# Altium project SecurityCard.PrjPcb (part 1 of 3)
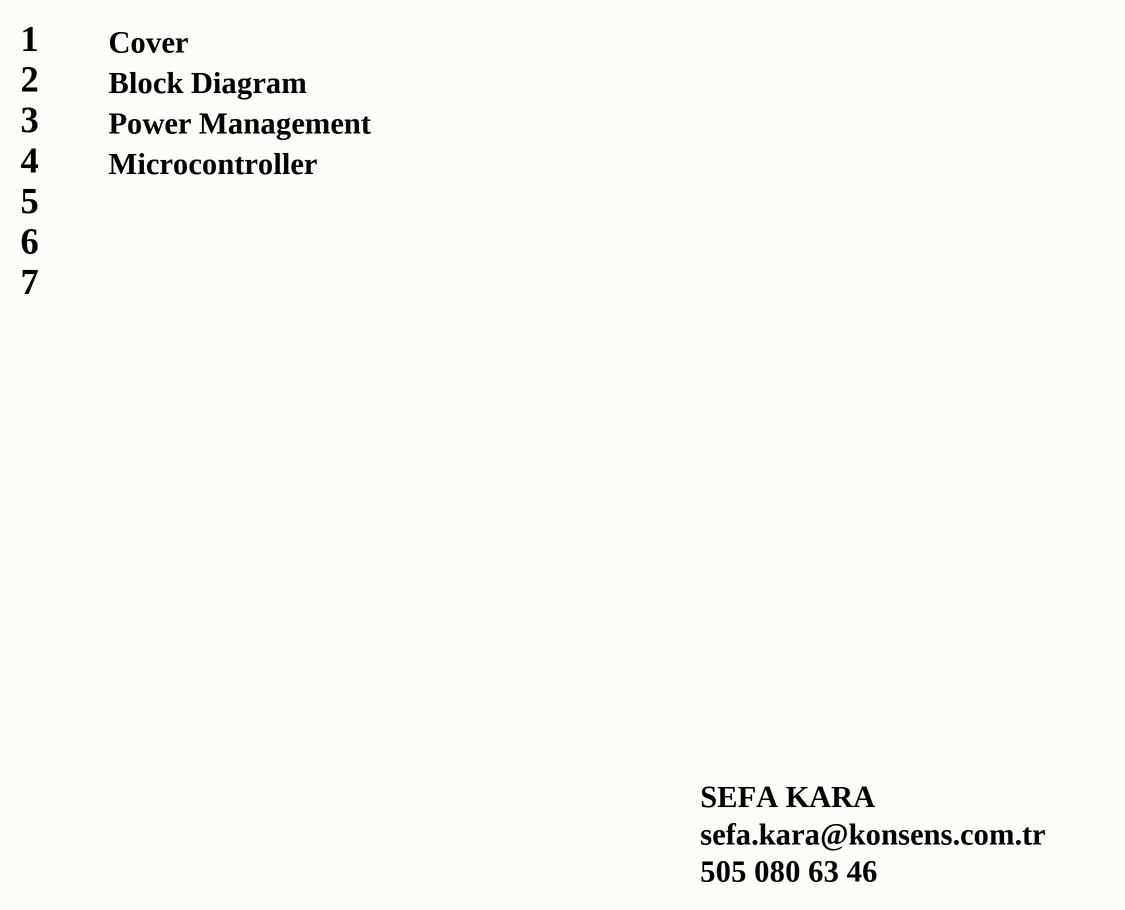
[diagram p0: Cover.SchDoc]
5 sheets, 124 parts. Net scope: flat (ports and power ports of the same name join across sheets).
Board file: SecurityCard.PcbDoc
Sheets:
  Cover.SchDoc
  BlockDiagram.SchDoc
  Power Management.SchDoc
  Microcontroller.SchDoc
  SensorBoard.SchDoc

## Sheet Cover.SchDoc
size A3; Date: 08/07/2024; ApprovedBy: SEFA KARA; CheckedBy: SEFA KARA; CompanyName: KONSENS TECH; Engineer: SEFA KARA; Revision: V1.0; SheetNumber: 1; SheetTotal: 4; PreparedBy: SEFA KARA; Project: SECURITY CARD; ReleaseDate: 08/07/2024; ChangedDate: 08/07/2024; RevisionDate: 08/07/2024; PreparedDate: 08/07/2024; CheckedDate: 08/07/2024; ApprovedDate: 08/07/2024; Department: R&D; Rel Date: 08/07/2024; Change Date: 08/07/2024; Rev Date: 08/07/2024; Time: 19:34

### Notes on the sheet
- 1
- Cover
- 2
- Block Diagram
- 3
- 4
- Power Management
- Microcontroller
- 5
- 6
- 7
- SEFA KARA
- sefa.kara@konsens.com.tr
- 505 080 63 46
- CONTENTS
- REVISION
- PRODUCTION NOTES
- Page No
- Description
- Date
- PROPERTIES
- BOARD
- GERBER
- FILES
- APPENDICES
- CONTACT
- Company Name
- Engineer
- PROJECT
- Rel Date
- FILE NAME
- Checked By
- Approved By
- Rev Date
- Change Date
- Department
- Revision
- Sheet
- of

## Sheet BlockDiagram.SchDoc
size A3; SheetNumber: 2; SheetTotal: 2
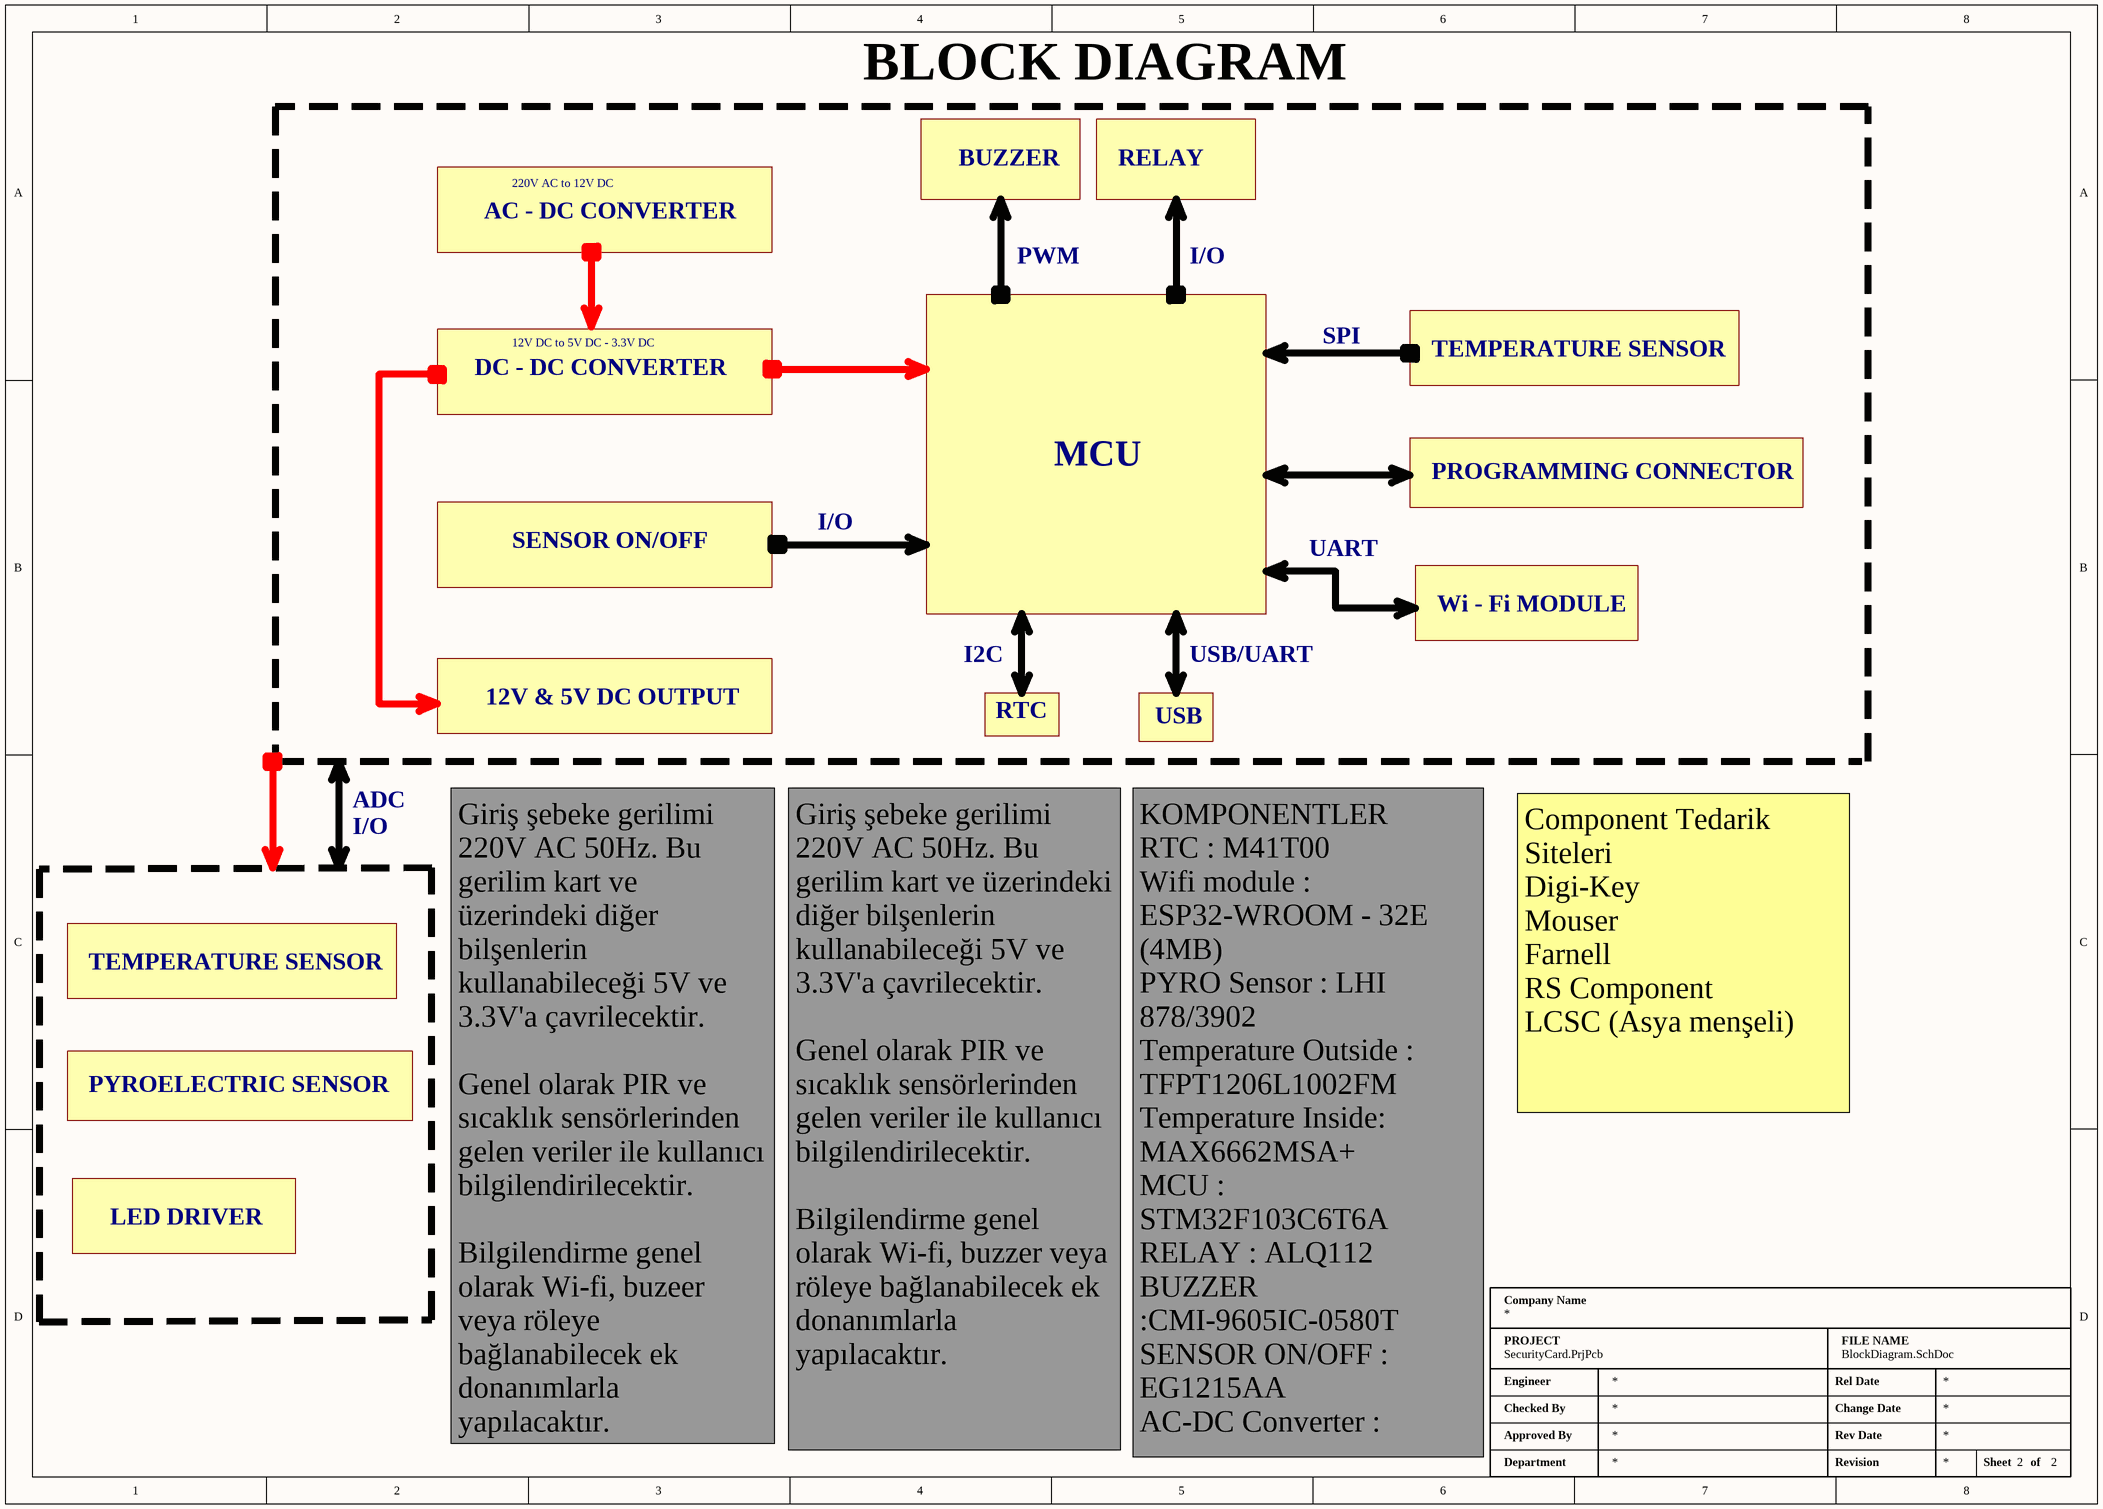
[diagram p1: BlockDiagram.SchDoc]

### Notes on the sheet
- BLOCK DIAGRAM
- BUZZER
- RELAY
- AC - DC CONVERTER
- 220V AC to 12V DC
- PWM
- I/O
- DC - DC CONVERTER
- 12V DC to 5V DC - 3.3V DC
- SPI
- TEMPERATURE SENSOR
- MCU
- PROGRAMMING CONNECTOR
- SENSOR ON/OFF
- UART
- Wi - Fi MODULE
- 12V & 5V DC OUTPUT
- I2C
- RTC
- USB/UART
- USB
- ADC
- PYROELECTRIC SENSOR
- Component Tedarik Siteleri
  Digi-Key
  Mouser
  Farnell
  RS Component
  LCSC (Asya menşeli)
- LED DRIVER
- Giriş şebeke gerilimi 220V AC 50Hz. Bu gerilim kart ve üzerindeki diğer bilşenlerin kullanabileceği 5V ve 3.3V'a çavrilecektir.
  Genel olarak PIR ve sıcaklık sensörlerinden gelen veriler ile kullanıcı bilgilendirilecektir.
  Bilgilendirme genel olarak Wi-fi, buzeer veya röleye bağlanabilecek ek donanımlarla yapılacaktır.
- Giriş şebeke gerilimi 220V AC 50Hz. Bu gerilim kart ve üzerindeki diğer bilşenlerin kullanabileceği 5V ve 3.3V'a çavrilecektir.
  Genel olarak PIR ve sıcaklık sensörlerinden gelen veriler ile kullanıcı bilgilendirilecektir.
  Bilgilendirme genel olarak Wi-fi, buzzer veya röleye bağlanabilecek ek donanımlarla yapılacaktır.
- KOMPONENTLER
  RTC : M41T00
  Wifi module : ESP32-WROOM - 32E (4MB)
  PYRO Sensor : LHI 878/3902
  Temperature Outside : TFPT1206L1002FM
  Temperature Inside: MAX6662MSA+
  MCU : STM32F103C6T6A
  RELAY : ALQ112
  BUZZER :CMI-9605IC-0580T
  SENSOR ON/OFF : EG1215AA
  AC-DC Converter :
  5VDC LM2675MX-12/NOPB
  3.3VDC AP7361-33E-13
  LED Driver Mosfet : SSM7K357R,LF
- Company Name
- Engineer
- PROJECT
- Rel Date
- FILE NAME
- Checked By
- Approved By
- Rev Date
- Change Date
- Department
- Revision
- Sheet
- of

## Sheet Power Management.SchDoc
size A3; ApprovedBy: SEFA KARA; CheckedBy: SEFA KARA; CompanyName: KONSENS TECH; Engineer: SEFA KARA; Revision: V1.0; SheetNumber: 3; SheetTotal: 4; Department: R&D; Rel Date: 17.08.2024; Change Date: 17.08.2024; Rev Date: 17.08.2024
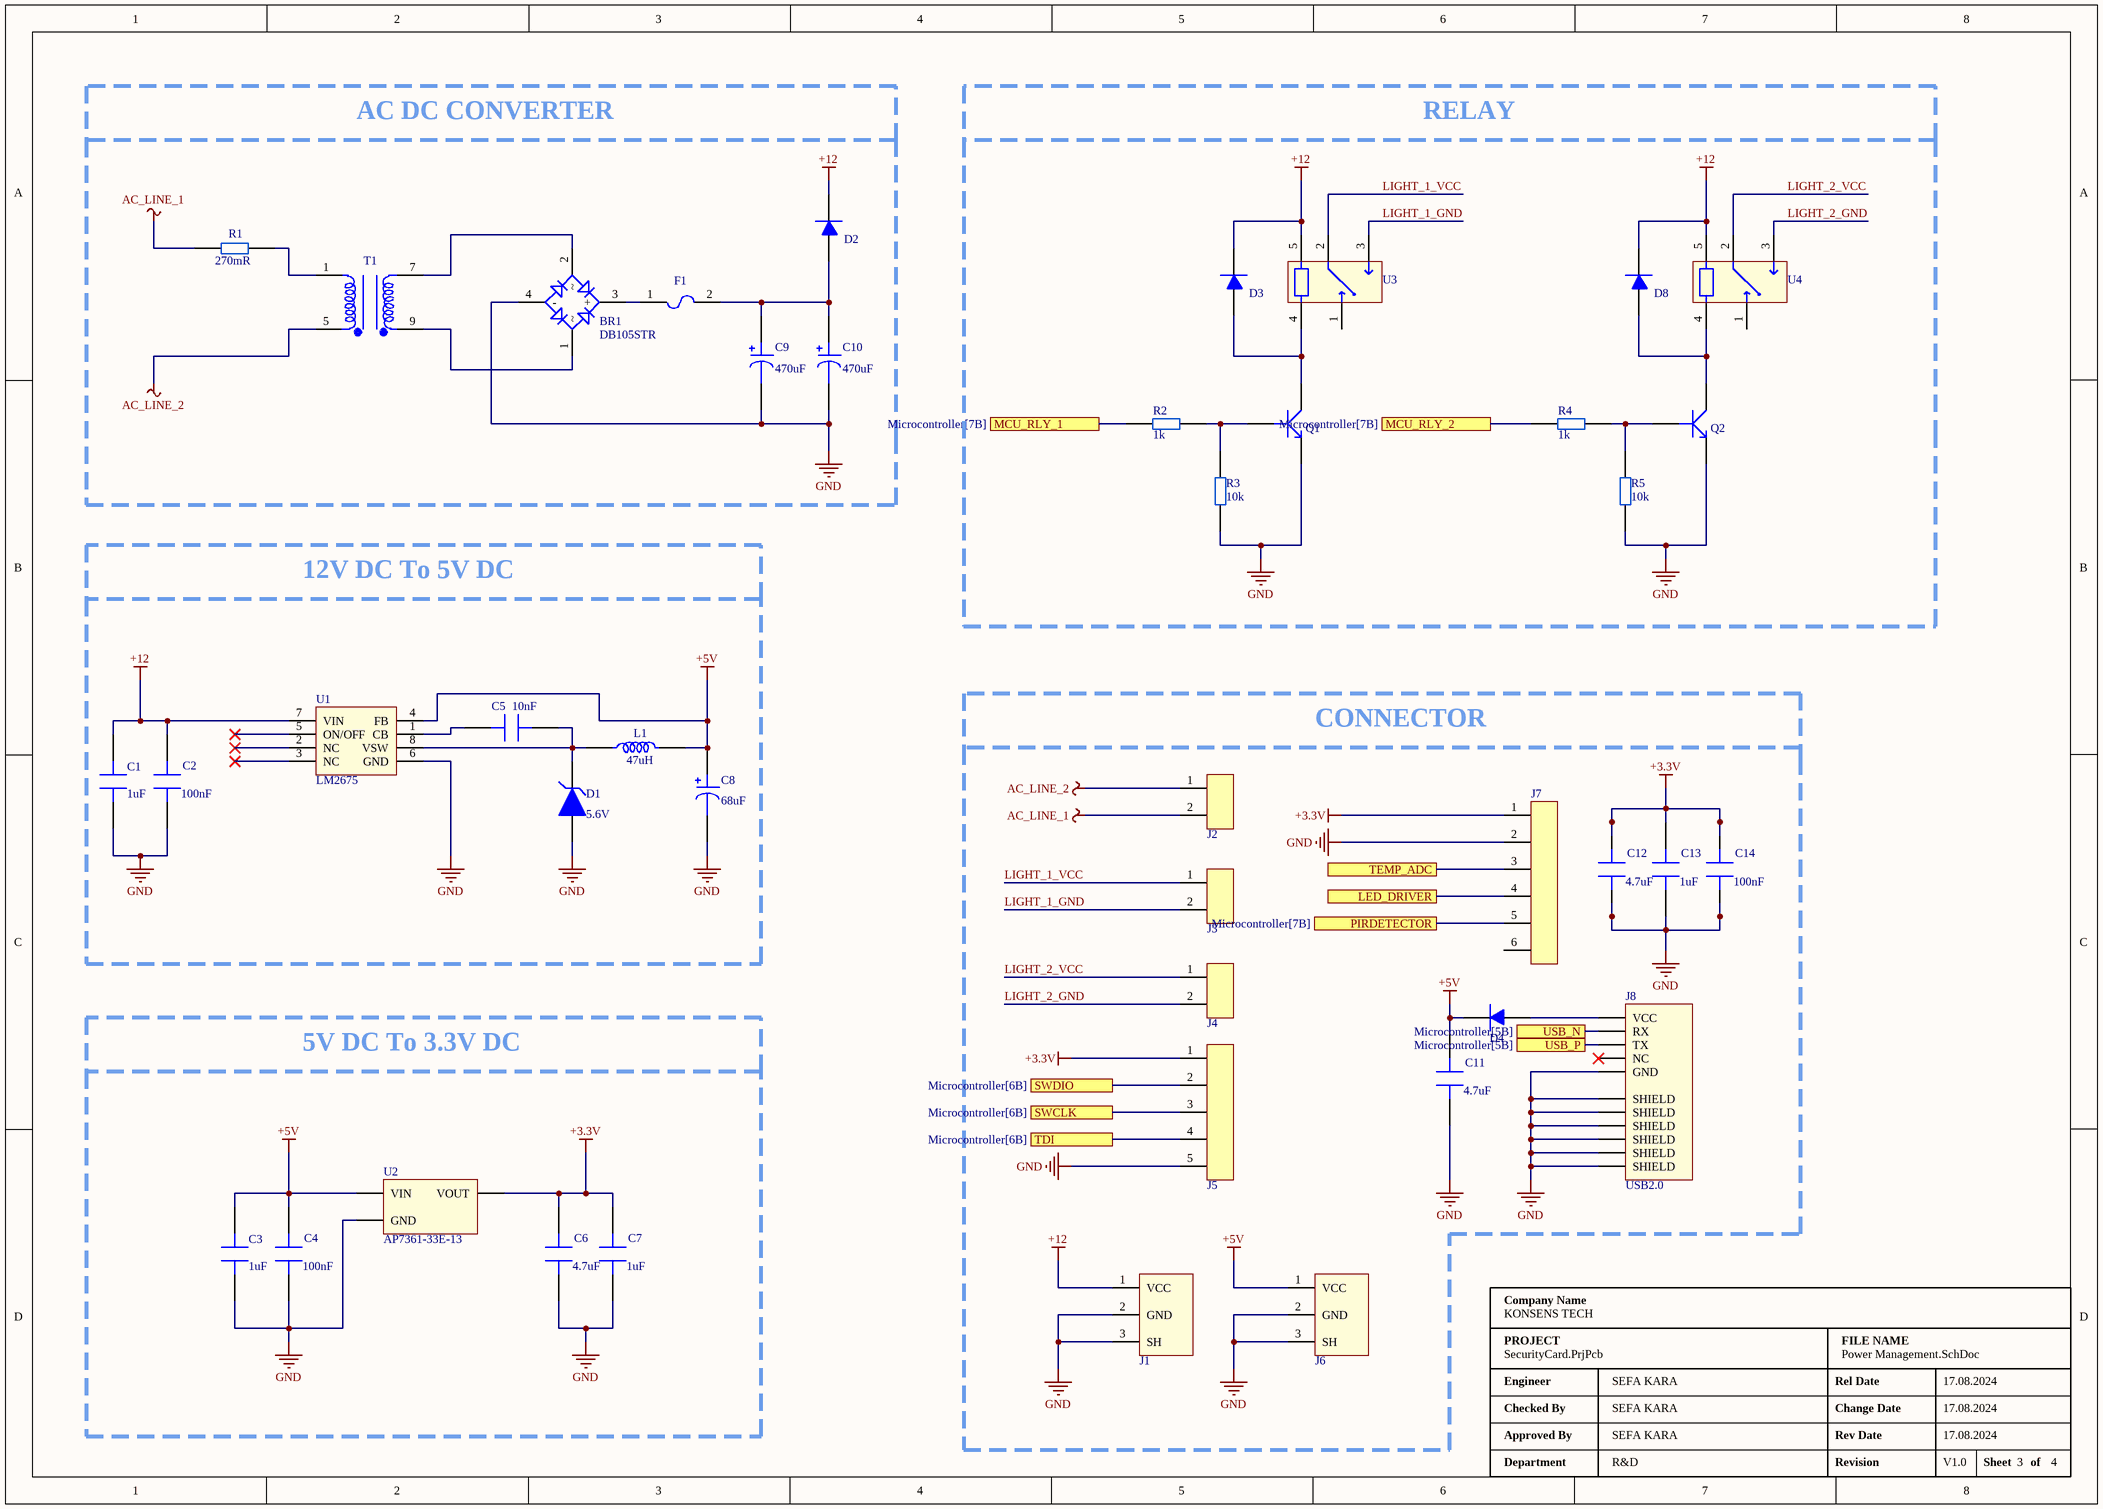
[diagram p2: Power Management.SchDoc]

### Parts
BR1  DB105STR  [DB107S]
C1  value 1uF  [CAP 0805]  (hidden comment: Auto Grade Capacitor,0805,X7R,10)
C2  value 100nF  [CAP 0805]  (hidden comment: CAP CER 0.1UF 50V X7R 0805)
C3  value 1uF  [CAP 0805]  (hidden comment: Auto Grade Capacitor,0805,X7R,10)
C4  value 100nF  [CAP 0805]  (hidden comment: CAP CER 0.1UF 50V X7R 0805)
C5  value 10nF  [CAP 0603]  (hidden comment: CAP CER 10nF 0603)
C6  value 4.7uF  [CAP 0805]  (hidden comment: CAP CER 4.7UF 25V X5R 0805)
C7  value 1uF  [CAP 0805]  (hidden comment: Auto Grade Capacitor,0805,X7R,10)
C8  value 68uF  [CAP ALUM 68uF 20% 35V RADIAL TH]  (hidden comment: CAP ALUM 68UF 20% 35V RADIAL TH)
C9  value 470uF  [CAP ALUM 470UF 20% 50V RADIAL TH]  (hidden comment: CAP ALUM 470UF 20% 50V RADIAL TH)
C10  value 470uF  [CAP ALUM 470UF 20% 50V RADIAL TH]  (hidden comment: CAP ALUM 470UF 20% 50V RADIAL TH)
C11  value 4.7uF  [CAP 0805]  (hidden comment: CAP CER 4.7UF 25V X5R 0805)
C12  value 4.7uF  [CAP 0805]  (hidden comment: CAP CER 4.7UF 25V X5R 0805)
C13  value 1uF  [CAP 0805]  (hidden comment: Auto Grade Capacitor,0805,X7R,10)
C14  value 100nF  [CAP 0805]  (hidden comment: CAP CER 0.1UF 50V X7R 0805)
D1  Voltage Rating (DC): 5.6V  [SMB]  (hidden comment: DIODE ZENER 5.6V 3W SMB)
D2  DIODE GEN PURP 75V 150MA SOD323F  [DIODE SOD323F]  (value not drawn)
D3  DIODE GEN PURP 75V 150MA SOD323F  [DIODE SOD323F]  (value not drawn)
D4  DIODE GEN PURP 75V 150MA SOD323F  [DIODE SOD323F]  (value not drawn)
D8  DIODE GEN PURP 75V 150MA SOD323F  [DIODE SOD323F]  (value not drawn)
F1  FUSE BRD MNT 1A 32VAC 63VDC 1206  [FUSE 1206 SMD]  (value not drawn)
J1  CONN PWR JACK 2X5.5MM SOLDER  [POWER JACK]  (value not drawn)
J2  TERMINAL BLOCK, PLUGGABLE, 5.08,  [TERMINAL 2P 508]  (value not drawn)
J3  TERMINAL BLOCK, PLUGGABLE, 5.08,  [TERMINAL 2P 508]  (value not drawn)
J4  TERMINAL BLOCK, PLUGGABLE, 5.08,  [TERMINAL 2P 508]  (value not drawn)
J5  CONN RCPT 5POS 0.1 GOLD SMD R/A  [PIN HEADER 5P 2.54mm MH-105-02-L-S]  (value not drawn)
J6  CONN PWR JACK 2X5.5MM SOLDER  [POWER JACK]  (value not drawn)
J7  CONN HEADER VERT 6POS 1.5MM  [TUNIK 6P 2.5mm]  (value not drawn)
J8  USB2.0  [MICRO B USB CONN]
L1  value 47uH  [IND 1212]  (hidden comment: FIXED IND 47UH 390MA 2.3 OHM SMD)
Q1  TRANS NPN 40V 0.2A SOT23  [SOT-23-3]  (value not drawn)
Q2  TRANS NPN 40V 0.2A SOT23  [SOT-23-3]  (value not drawn)
R1  value 270mR  [SQP500JB-10R]  (hidden comment: RES 0.27 OHM 5% 5W AXIAL)
R2  value 1k  [RES 0603]  (hidden comment: RES 10K 0603)
R3  value 10k  [RES 0603]  (hidden comment: RES 10K 0603)
R4  value 1k  [RES 0603]  (hidden comment: RES 10K 0603)
R5  value 10k  [RES 0603]  (hidden comment: RES 10K 0603)
T1  BV302S12010-ZU  [BV302S]  (value not drawn)
U1  LM2675  [SOIC8]
U2  AP7361-33E-13  [SOT223]
U3  ALQ112  [RELAY ALQ112]  (value not drawn)
U4  ALQ112  [RELAY ALQ112]  (value not drawn)

### Blocks framed on the sheet
AC DC CONVERTER: BR1 C9 C10 D2 F1 R1 T1
RELAY: D3 D8 Q1 Q2 R2-R5 U3 U4
12V DC To 5V DC: C1 C2 C5 C8 D1 L1 U1
CONNECTOR: C11-C14 D4 J1-J8
5V DC To 3.3V DC: C3 C4 C6 C7 U2

### Ports
LED_DRIVER (see Microcontroller[7B], SensorBoard[4D], SensorBoard[6B]), MCU_RLY_1 (see Microcontroller[7B]), MCU_RLY_2 (see Microcontroller[7B]), PIRDETECTOR (see Microcontroller[7B]), SWCLK (see Microcontroller[6B]), SWDIO (see Microcontroller[6B]), TDI (see Microcontroller[6B]), TEMP_ADC (see Microcontroller[7A], SensorBoard[3D], SensorBoard[6A]), USB_N (see Microcontroller[5B]), USB_P (see Microcontroller[5B])

### Nets
+3.3V: C6.1 C7.2 C12.2 C13.2 C14.2 J5.1 J7.1 U2.3(VOUT)
+5V: C3.2 C4.2 C8.1 C11.2 D4.C J6.1(VCC) L1.2 U1.4(FB) U2.1(VIN)
+12: C1.2 C2.2 D2.C D3.C D8.C J1.1(VCC) U1.7(VIN) U3.5 U4.5
AC_LINE_1: J2.2 R1.1
AC_LINE_2: J2.1 T1.5
GND: BR1.4(-) C1.1 C2.1 C3.1 C4.1 C6.2 C7.1 C8.2 C9.2 C10.2 C11.1 C12.1 C13.1 C14.1 D1.A J1.2(GND) J1.3(SH) J5.5 J6.2(GND) J6.3(SH) J7.2 J8.5(GND) J8.SH1(SHIELD) J8.SH2(SHIELD) J8.SH3(SHIELD) J8.SH4(SHIELD) J8.SH5(SHIELD) J8.SH6(SHIELD) Q1.2(E) Q2.2(E) R3.1 R5.1 U1.6(GND) U2.2(GND)
LIGHT_1_GND: J3.2 U3.3
LIGHT_1_VCC: J3.1 U3.2
LIGHT_2_GND: J4.2 U4.3
LIGHT_2_VCC: J4.1 U4.2
USB_N: J8.2(RX) ; port USB_N
USB_P: J8.3(TX) ; port USB_P
NetBR1_1: BR1.1 T1.9
NetBR1_2: BR1.2 T1.7
NetBR1_3: BR1.3(+) F1.1
NetC5_1: C5.1 U1.1(CB)
NetC5_2: C5.2 D1.C L1.1 U1.8(VSW)
NetC9_1: C9.1 C10.1 D2.A F1.2
NetC39_2: J7.3 ; port TEMP_ADC
NetD3_A: D3.A Q1.3(C) U3.4
NetD4_A: D4.A J8.1(VCC)
NetD8_A: D8.A Q2.3(C) U4.4
NetJ5_2: J5.2 ; port SWDIO
NetJ5_3: J5.3 ; port SWCLK
NetJ5_4: J5.4 ; port TDI
NetJ7_4: J7.4 ; port LED_DRIVER
NetJ7_5: J7.5 ; port PIRDETECTOR
NetQ1_1: Q1.1(B) R2.1 R3.2
NetQ2_1: Q2.1(B) R4.1 R5.2
NetR1_2: R1.2 T1.1
NetR2_2: R2.2 ; port MCU_RLY_1
NetR4_2: R4.2 ; port MCU_RLY_2

Not connected (* = marked no-connect by the designer): J7 6; J8 4(NC)*; U1 2(NC)* 3(NC)* 5(ON/OFF)*; U3 1; U4 1

### Notes on the sheet
- 230VAC 50Hz Input
- Company Name
- Engineer
- PROJECT
- Rel Date
- FILE NAME
- Checked By
- Approved By
- Rev Date
- Change Date
- Department
- Revision
- Sheet
- of

### Library data of the parts
BR1 = DB105STR: Bridge Rect 1PHASE 600V 1A Db-s; Manufacturer: SMC; Designed By: SEFA; Supplier: Future Electronics; Supplier Part Number: 5119461; Manufacturer Part Number: DB105STR; RoHS: No; Category: Industrial Control; Pricing: 1500=0,0612, 4500=0,0587, 7500=0,0576, 22500=0,0554, 37500=0,0534 (USD); Mounting Technology: Surface Mount; Case/Package: SMD/SMT; Min Operating Temperature: -55°C; Max Operating Temperature: 150°C; Packaging: Tape and Reel; Average Rectified Current: 1A; ComponentLink1URL: http://www.smc-diodes.com/propdf/DB101S%20THRU%20DB107S%20N1459%20REV.B.pdf?src-supplier=Digikey; ComponentLink1Description: http://www.smc-diodes.com/propdf/DB101S%20THRU%20DB107S%20N1459%20REV.B.pdf?src-supplier=Digikey
C1 C3 C7 C13 = CAP MLCC 1uF 0805 MLCC: Multilayer Ceramic Capacitor, 1 uF, 25 V, ï¿½ 10%, X7R, 0805 [2012 Metric]; Manufacturer: KEMET; Manufacturer Part Number: C0805C105K3RACTU; Material: 4241ConductorMaterial; Voltage Rating: 25V; Supplier: Digikey; Supplier Part Number: 399-C0805C105K3RAC7800CT-ND; RoHS: Yes; Category: Ceramic Capacitors; Stock: 115775; Pricing: 1=0,13, 10=0,091, 50=0,054, 100=0,0425, 500=0,03142, 1000=0,02601 (USD); Mounting Technology: Surface Mount; Case/Package: 0805; Pins: 2; Case Code (Imperial): 0805; Case Code (Metric): 2012; Dielectric Material: Ceramic; Min Operating Temperature: -55°C; Max Operating Temperature: 125°C; Tolerance: 10%; Packaging: Tape and Reel; Termination: SMD/SMT; Series: C; Dielectric: X7R; Package Quantity: 2500; Voltage Rating (DC): 25V; Construction: Flat; Voltage: 25V; Length: 2mm; Width: 0.049inch; Height: 1.25mm; Depth: 1.25mm; Thickness: 0.055inch; Radiation Hardening: No; RoHS Compliant: Yes; Reach SVHC Compliant: No
C2 C4 C14 = CAP MLCC 100nF 0805: Multilayer Ceramic Capacitor, 0.1 uF, 50 V, ± 10%, X7R, 0805 [2012 Metric]; Manufacturer: Yageo; Manufacturer Part Number: CC0805KRX7R9BB104; Insulation Resistance: 100GR; Desined By: SEFA; Supplier: Digikey; Supplier Part Number: 311-1140-1-ND; RoHS: Yes; Category: Ceramic Capacitors; Stock: 4906465; Pricing: 1=0,1, 10=0,07, 50=0,0418, 100=0,0329, 500=0,02428, 1000=0,0201, 4000=0,01711, 8000=0,01592, 12000=0,01512, 28000=0,01433, 100000=0,01085, 200000=0,01059, 400000=0,00995 (USD); Mounting Technology: Surface Mount; Case/Package: 0805; Pins: 2; Case Code (Metric): 2012; Case Code (Imperial): 0805; Material: Ceramic; Min Operating Temperature: -55°C; Max Operating Temperature: 125°C; Tolerance: 10%; Dielectric: X7R; Voltage: 50V; Packaging: Tape and Reel; Voltage Rating: 50V; Package Quantity: 4000; Termination: SMD/SMT; Series: CC; Length: 2mm; Height: 0.85mm; Depth: 1.25mm; Radiation Hardening: No; RoHS Compliant: Yes; Reach SVHC Compliant: No; Lead Free: 5697LeadFree; Halogen Free: 5694HalogenFree; ComponentLink1URL: https://datasheet.ciiva.com/11786/0900766b80d84f1d-11786009.pdf?src-supplier=Rs; ComponentLink1Description: https://datasheet.ciiva.com/11786/0900766b80d84f1d-11786009.pdf?src-supplier=Rs; ComponentLink2URL: https://datasheet.ciiva.com/46393/1734573-46393307.pdf?src-supplier=Element14; ComponentLink2Description: https://datasheet.ciiva.com/46393/1734573-46393307.pdf?src-supplier=Element14; ComponentLink3URL: https://datasheet.ciiva.com/155/mlccorderingcode-155930.pdf?src-supplier=Digikey; ComponentLink3Description: https://datasheet.ciiva.com/155/mlccorderingcode-155930.pdf?src-supplier=Digikey; ComponentLink4URL: https://datasheet.ciiva.com/28450/1489800-28450805.pdf?src-supplier=Element14; ComponentLink4Description: https://datasheet.ciiva.com/28450/1489800-28450805.pdf?src-supplier=Element14; ComponentLink5URL: https://datasheet.ciiva.com/155/mlccorderingcode-155929.pdf?src-supplier=Digikey; ComponentLink5Description: https://datasheet.ciiva.com/155/mlccorderingcode-155929.pdf?src-supplier=Digikey; ComponentLink6URL: https://datasheet.ciiva.com/155/mlccorderingcode-155931.pdf?src-supplier=Digikey; ComponentLink6Description: https://datasheet.ciiva.com/155/mlccorderingcode-155931.pdf?src-supplier=Digikey; ComponentLink7URL: https://datasheet.ciiva.com/11464/upy-gphc-x7r-6-3v-to-50v-8-11464757.pdf?src-supplier=Avnet; ComponentLink7Description: https://datasheet.ciiva.com/11464/upy-gphc-x7r-6-3v-to-50v-8-11464757.pdf?src-supplier=Avnet; ComponentLink8URL: https://datasheet.ciiva.com/29242/445210-da-01-en-kerko-chip-0805-x7r-0-1uf-10proz-50vg-29242074.pdf?src-supplier=Conrad; ComponentLink8Description: https://datasheet.ciiva.com/29242/445210-da-01-en-kerko-chip-0805-x7r-0-1uf-10proz-50vg-29242074.pdf?src-supplier=Conrad
C5 = CAP MLCC 10nF 0603: Multilayer Ceramic Capacitor, 0.01 uF, 50 V, ± 10%, X7R, 0603 [1608 Metric]; Manufacturer: Yageo; Manufacturer Part Number: CC0603KRX7R9BB103; Voltage Rating: 50V; Insulation Resistance: 100GR; Designed By: SEFA; Supplier: Digikey; Supplier Part Number: 311-1085-1-ND; RoHS: Yes; Category: Ceramic Capacitors; Stock: 4173563; Pricing: 1=0,1, 10=0,031, 50=0,0176, 100=0,0136, 500=0,01026, 1000=0,00805 (USD); Mounting Technology: Surface Mount; Case/Package: 0603; Pins: 2; Case Code (Metric): 1608; Case Code (Imperial): 0603; Material: Ceramic; Min Operating Temperature: -55°C; Max Operating Temperature: 125°C; Tolerance: 10%; Packaging: Tape and Reel; Voltage Rating (DC): 50V; Package Quantity: 1; Dielectric: X7R; Termination: SMD/SMT; Voltage: 50V; Series: CC; Length: 1.6mm; Width: 0.031inch; Height: 0.8mm; Thickness: 0.035inch; Depth: 0.8mm; Radiation Hardening: No; RoHS Compliant: Yes; Reach SVHC Compliant: Unknown; Lead Free: 5697LeadFree; Halogen Free: 5694HalogenFree
C6 C11 C12 = CAP MLCC 4.7uF 0805 MLCC: Multilayer Ceramic Capacitor, 4.7 uF, 25 V, ± 10%, X5R, 0805 [2012 Metric]; Manufacturer: Samsung; Manufacturer Part Number: CL21A475KAQNNNE; Designed By: SEFA; Supplier: Digikey; Supplier Part Number: 1276-1244-2-ND; RoHS: Yes; Category: Ceramic Capacitors; Stock: 3176000; Pricing: 2000=0,01305, 4000=0,01194, 10000=0,0111, 14000=0,01055, 50000=0,00978 (USD); Mounting Technology: Surface Mount; Case/Package: 0805; Case Code (Metric): 2012; Case Code (Imperial): 0805; Material: Ceramic; Min Operating Temperature: -55°C; Max Operating Temperature: 85°C; Packaging: Tape and Reel; Tolerance: 10%; Voltage Rating: 25V; Dielectric: X5R; Voltage Rating (DC): 25V; Series: CL; Construction: Flat; Length: 2mm; Height: 1.25mm; Depth: 1.25mm; Radiation Hardening: No; Lead Free: Lead Free; RoHS Compliant: Yes; ComponentLink1URL: https://datasheet.ciiva.com/25798/cl21a475kaqnnne-25798882.pdf?src-supplier=Digikey; ComponentLink1Description: https://datasheet.ciiva.com/25798/cl21a475kaqnnne-25798882.pdf?src-supplier=Digikey
C8 = CAP 68uF 35V: 68 µF 35 V Aluminum Electrolytic Capacitors Radial, Can 2000 Hrs @ 85°C; Manufacturer: Wurth Electronics; Manufacturer Part Number: 860010573006; Ripple Current: 198mA; Designed By: SEFA; Supplier: Digikey; Supplier Part Number: 732-8736-1-ND; RoHS: Yes; Category: Aluminum Electrolytic Capacitors; Stock: 1439; Pricing: 1=0,13, 50=0,115, 100=0,1, 250=0,089, 500=0,078 (USD); Mounting Technology: Through Hole; Case/Package: Radial; Min Operating Temperature: -40°C; Max Operating Temperature: 85°C; Package Quantity: 1500; Packaging: Cut Tape; Voltage Rating: 35V; Tolerance: 20%; Voltage Rating (DC): 35V; Series: WCAP-ATG8; Diameter: 6.3mm; Height: 11mm; Lead Pitch: 0.098inch; Height - Seated (Max): 0.492inch; RoHS Compliant: Yes; Reach SVHC Compliant: Unknown; ComponentLink1URL: http://www.farnell.com/datasheets/1879546.pdf?src-supplier=Farnell; ComponentLink1Description: http://www.farnell.com/datasheets/1879546.pdf?src-supplier=Farnell; ComponentLink2URL: http://www.farnell.com/datasheets/1879546.pdf?src-supplier=Element14; ComponentLink2Description: http://www.farnell.com/datasheets/1879546.pdf?src-supplier=Element14; ComponentLink3URL: http://katalog.we-online.de/pbs/datasheet/860010573006.pdf?src-supplier=Digikey; ComponentLink3Description: http://katalog.we-online.de/pbs/datasheet/860010573006.pdf?src-supplier=Digikey
C9 C10 = 470uF ECAP CA-1HM471: Aluminum Electrolytic Capacitor, 470 uF, 63 V, ± 20%, 8000 hours @ 85°C, Axial Leaded; Manufacturer: Vishay BCcomponents; Manufacturer Part Number: MAL202118471E3; Voltage Rating (AC): 63V; Desined By: SEFA; Supplier: Digikey; Supplier Part Number: 4079PHBK-ND; RoHS: Yes; Category: Aluminum Electrolytic Capacitors; Stock: 707; Pricing: 1=4,14, 10=3,177, 50=2,87, 260=2,13581, 520=1,93558, 1040=1,80209, 2600=1,73534, 5200=1,70197 (USD); ComponentLink1URL: https://datasheet.ciiva.com/33738/1796733-33738999.pdf?src-supplier=Farnell; ComponentLink1Description: https://datasheet.ciiva.com/33738/1796733-33738999.pdf?src-supplier=Farnell; ComponentLink2URL: https://datasheet.ciiva.com/11778/0900766b8009bd71-11778242.pdf?src-supplier=Rs; ComponentLink2Description: https://datasheet.ciiva.com/11778/0900766b8009bd71-11778242.pdf?src-supplier=Rs; ComponentLink3URL: https://datasheet.ciiva.com/18442/70122962-18442364.pdf?src-supplier=Allied+Electronics; ComponentLink3Description: https://datasheet.ciiva.com/18442/70122962-18442364.pdf?src-supplier=Allied+Electronics; ComponentLink4URL: https://datasheet.ciiva.com/5331/021asm-239741-5331263.pdf?src-supplier=Mouser; ComponentLink4Description: https://datasheet.ciiva.com/5331/021asm-239741-5331263.pdf?src-supplier=Mouser; ComponentLink5URL: https://datasheet.ciiva.com/100/021asm-100166.pdf?src-supplier=Digikey; ComponentLink5Description: https://datasheet.ciiva.com/100/021asm-100166.pdf?src-supplier=Digikey; ComponentLink6URL: https://datasheet.ciiva.com/11697/021asm-11697518.pdf?src-supplier=Avnet; ComponentLink6Description: https://datasheet.ciiva.com/11697/021asm-11697518.pdf?src-supplier=Avnet
D1 = 1SMB5919BT3G ZENER DIODE: Diode Zener Single 5.6V 5% 550mW Automotive 2-Pin SMB T/R; Manufacturer: ON Semiconductor; Material: 4239ConductorMaterial; Breakdown Voltage: 5.88V; Designed By: SEFA; Supplier: Digikey; Supplier Part Number: 1SMB5919BT3GOSCT-ND; Manufacturer Part Number: 1SMB5919BT3G; RoHS: Yes; Category: Zener Diodes; Stock: 31320; Pricing: 1=0,48, 10=0,341, 100=0,1722, 500=0,15262, 1000=0,11878 (USD); Power Rating: 3W; Lead Free: 5697LeadFree; Halogen Free: 5694HalogenFree; ComponentLink1URL: https://datasheet.ciiva.com/27747/1308331-27747654.pdf?src-supplier=Jameco; ComponentLink1Description: https://datasheet.ciiva.com/27747/1308331-27747654.pdf?src-supplier=Jameco; ComponentLink2URL: https://datasheet.ciiva.com/1182/1smb5913bt3-d-1182657.pdf?src-supplier=Element14; ComponentLink2Description: https://datasheet.ciiva.com/1182/1smb5913bt3-d-1182657.pdf?src-supplier=Element14; ComponentLink3URL: https://datasheet.ciiva.com/1182/1smb5913bt3-d-1182658.pdf?src-supplier=Element14; ComponentLink3Description: https://datasheet.ciiva.com/1182/1smb5913bt3-d-1182658.pdf?src-supplier=Element14; ComponentLink4URL: https://datasheet.ciiva.com/895/1smb5913bt3-d-895203.pdf?src-supplier=Digikey; ComponentLink4Description: https://datasheet.ciiva.com/895/1smb5913bt3-d-895203.pdf?src-supplier=Digikey; ComponentLink5URL: https://datasheet.ciiva.com/895/1smb5913bt3-d-895204.pdf?src-supplier=Digikey; ComponentLink5Description: https://datasheet.ciiva.com/895/1smb5913bt3-d-895204.pdf?src-supplier=Digikey; ComponentLink6URL: https://datasheet.ciiva.com/895/1smb5913bt3-d-895205.pdf?src-supplier=Digikey; ComponentLink6Description: https://datasheet.ciiva.com/895/1smb5913bt3-d-895205.pdf?src-supplier=Digikey; ComponentLink7URL: https://datasheet.ciiva.com/15198/getdatasheetpartid-311040-15198695.pdf?src-supplier=Verical; ComponentLink7Description: https://datasheet.ciiva.com/15198/getdatasheetpartid-311040-15198695.pdf?src-supplier=Verical; ComponentLink8URL: https://datasheet.ciiva.com/16311/1smb5913bt3-d-16311847.pdf?src-supplier=Future+Electronics; ComponentLink8Description: https://datasheet.ciiva.com/16311/1smb5913bt3-d-16311847.pdf?src-supplier=Future+Electronics
D2-D4 D8 = DIODE 1N4148WS: Diode Ultra Fast Recovery Rectifier 75V 0.15A 2-Pin SOD-323F T/R; Manufacturer: ON Semiconductor / Fairchild; Max Reverse Current: 5uA; Reverse Recovery Time: 4ns; Max Forward Surge Current (Ifsm): 2A; Value: 4pF; Element Configuration: Single; Desined By: SEFA; Supplier: Digikey; Supplier Part Number: 1N4148WSFSCT-ND; Manufacturer Part Number: 1N4148WS; RoHS: Yes; Category: Rectifier Diodes; Stock: 198472; Pricing: 1=0,17, 10=0,104, 100=0,0639, 500=0,04644, 1000=0,04076 (USD); Mounting Technology: Surface Mount; Pins: 2; Weight: 0.0276g; Min Operating Temperature: -55°C; Max Operating Temperature: 150°C; Average Rectified Current: 150mA; Max Reverse Voltage (DC): 75V; Series: -; Packaging: Tape and Reel; Forward Current: 150mA; Package Quantity: 1; Recovery Time: 4ns; Max Repetitive Reverse Voltage (Vrrm): 75V; Reverse Voltage: 75V; Length: 1.8mm; Width: 1.35mm; Height: 1mm; Radiation Hardening: No; RoHS Compliant: Yes; Reach SVHC Compliant: No; Lead Free: 5697LeadFree; ComponentLink1URL: https://datasheet.ciiva.com/15208/getdatasheetpartid-127819-15208358.pdf?src-supplier=Verical; ComponentLink1Description: https://datasheet.ciiva.com/15208/getdatasheetpartid-127819-15208358.pdf?src-supplier=Verical; ComponentLink2URL: https://datasheet.ciiva.com/8300/1n914bws-8300360.pdf?src-supplier=Avnet; ComponentLink2Description: https://datasheet.ciiva.com/8300/1n914bws-8300360.pdf?src-supplier=Avnet
F1 = FUSE 3413.0216.22: Fuse Chip Fast Acting 1A 32V SMD Solder Pad 1206 Glass T/R VDE/cULus; Manufacturer: Schurter; Body Material: Glass,Epoxy; Voltage Rating (DC): 63V; DC Cold Resistance: 94.2mR; Fuse Type: Board Mount (Cartridge Style Excluded); Approvals: VDE,cURus; Designed By: SEFA; Supplier: Digikey; Supplier Part Number: 486-1144-1-ND; Manufacturer Part Number: 3413.0216.22; RoHS: Yes; Category: Fuses; Stock: 16348; Pricing: 1=0,67, 50=0,524, 100=0,397, 500=0,345 (USD); Mounting Technology: Surface Mount,PCB; Case/Package: 1206; Pins: 2; Weight: 0.000212oz; Case Code (Metric): 3216; Case Code (Imperial): 1206; Contact Plating: Gold; Terminal Material: Tin; Min Operating Temperature: -55°C; Max Operating Temperature: 90°C; Package Quantity: 1000; Voltage Rating (AC): 32V; Packaging: Tape and Reel; Voltage Rating: 32V; Termination: SMD/SMT; Working Voltage: 32V; Series: USI 1206; Length: 3.2mm; Width: 1.6mm; Height: 0.6mm; Lead Free: Lead Free; RoHS Compliant: Yes; ComponentLink1URL: https://datasheet.ciiva.com/301/typ-usi-1206-301440.pdf?src-supplier=Digikey; ComponentLink1Description: https://datasheet.ciiva.com/301/typ-usi-1206-301440.pdf?src-supplier=Digikey; ComponentLink2URL: https://datasheet.ciiva.com/8264/typ-usi-1206-8264583.pdf?src-supplier=Avnet; ComponentLink2Description: https://datasheet.ciiva.com/8264/typ-usi-1206-8264583.pdf?src-supplier=Avnet; ComponentLink3URL: https://datasheet.ciiva.com/16316/typ-usi-1206-16316588.pdf?src-supplier=Future+Electronics; ComponentLink3Description: https://datasheet.ciiva.com/16316/typ-usi-1206-16316588.pdf?src-supplier=Future+Electronics; ComponentLink4URL: https://datasheet.ciiva.com/301/typ-usi-1206-301439.pdf?src-supplier=Digikey; ComponentLink4Description: https://datasheet.ciiva.com/301/typ-usi-1206-301439.pdf?src-supplier=Digikey; ComponentLink5URL: https://datasheet.ciiva.com/14541/70160006-14541114.pdf?src-supplier=Allied+Electronics; ComponentLink5Description: https://datasheet.ciiva.com/14541/70160006-14541114.pdf?src-supplier=Allied+Electronics; ComponentLink6URL: https://datasheet.ciiva.com/14102/qousi1206-data-e-14102903.pdf?src-supplier=Distrelec; ComponentLink6Description: https://datasheet.ciiva.com/14102/qousi1206-data-e-14102903.pdf?src-supplier=Distrelec; ComponentLink7URL: https://datasheet.ciiva.com/301/typ-usi-1206-301441.pdf?src-supplier=Digikey; ComponentLink7Description: https://datasheet.ciiva.com/301/typ-usi-1206-301441.pdf?src-supplier=Digikey; Current Rating: 1A
J1 J6 = JACK CONN PJ-037AH-SMT-TR: 2.0 x 6.3 mm, 5.0 A, Horizontal, Surface Mount (SMT), Dc Power Jack Connector; Manufacturer: CUI; Number of Conductors: 2; Gender: Male; Shielding: Unshielded; Current Rating: 5A; Voltage Rating: 24V; Insulation Resistance: 100MR; Designed By: SEFA; Supplier: Mouser; Supplier Part Number: 490-PJ-037AH-SMT-TR; Manufacturer Part Number: PJ-037AH-SMT-TR; RoHS: Yes; Category: Uncategorized; Mounting Technology: Surface Mount,Through Hole; Case/Package: SMD/SMT; Color: Black; Contact Material: Copper; Contact Plating: Nickel; Housing Color: Black; Housing Material: Thermoplastic; Min Operating Temperature: -25°C; Max Operating Temperature: 85°C; Orientation: Horizontal; Package Quantity: 200; Termination: Solder; Connector Type: Jack; Contact Gender: Male; Packaging: Tape and Reel; Flammability Rating: UL94 V-0; ComponentLink1URL: http://www.mouser.com/ds/2/670/pj-037ah-smt-516065.pdf?src-supplier=Mouser; ComponentLink1Description: http://www.mouser.com/ds/2/670/pj-037ah-smt-516065.pdf?src-supplier=Mouser; ComponentLink2URL: https://www.cui.com/product/resource/digikeypdf/pj-037ah-smt-tr.pdf?src-supplier=Digikey; ComponentLink2Description: https://www.cui.com/product/resource/digikeypdf/pj-037ah-smt-tr.pdf?src-supplier=Digikey; ComponentLink3URL: http://www.cui.com/product/resource/digikeypdf/pj-037ah-smt.pdf?src-supplier=Digikey; ComponentLink3Description: http://www.cui.com/product/resource/digikeypdf/pj-037ah-smt.pdf?src-supplier=Digikey
J2-J4 = 2P TERMINAL TBP01R1-508-02BE: 2~24 Poles, Pluggable, Receptacle, Horizontal, 5.08 Pitch, Terminal Block Connector; Manufacturer: CUI Devices; Designed By: SEFA; Supplier: Digikey; Supplier Part Number: 102-6406-ND; Manufacturer Part Number: TBP01R1-508-02BE; RoHS: Yes; Category: Terminal Blocks; Stock: 96415; Pricing: 1=0,33, 10=0,176, 25=0,1244, 50=0,1058, 100=0,1022, 400=0,08638, 800=0,0743, 1200=0,07058, 5200=0,0654 (USD); ComponentLink1URL: https://www.cuidevices.com/product/resource/digikeypdf/tbp01r1-508.pdf?src-supplier=Digikey; ComponentLink1Description: https://www.cuidevices.com/product/resource/digikeypdf/tbp01r1-508.pdf?src-supplier=Digikey; ComponentLink2URL: https://datasheet.octopart.com/TBP01R1-508-02BE-CUI-Devices-datasheet-147843976.pdf?src-supplier=Future+Electronics; ComponentLink2Description: https://datasheet.octopart.com/TBP01R1-508-02BE-CUI-Devices-datasheet-147843976.pdf?src-supplier=Future+Electronics; ComponentLink3URL: https://datasheet.octopart.com/TBP01R1-508-02BE-CUI-Devices-datasheet-154730754.pdf?src-supplier=Electro+Sonic; ComponentLink3Description: https://datasheet.octopart.com/TBP01R1-508-02BE-CUI-Devices-datasheet-154730754.pdf?src-supplier=Electro+Sonic
J5 = PIN HEADER 2.54mm SMH-105-02-L-S: PCB Receptacle, Board-to-Board, 2.54 mm, 1 Rows, 5 Contacts, Surface Mount, SMH; Manufacturer: Samtec; Number of Contacts: 5; Pitch: 2.54mm; Designed By: SEFA; Supplier: Digikey; Supplier Part Number: SAM11813-ND; Manufacturer Part Number: SMH-105-02-L-S; RoHS: Yes; Category: Connectors; Stock: 2; Pricing: 1=2,01, 50=1,56, 100=1,26, 500=1,07, 1000=1 (USD); Contact Plating: Gold; Contact Material: Bronze; Contact Finish - Mating: GOLD; Insulation Color: Black; Insulation Material: Polymer; Contact Shape: Square; Min Operating Temperature: -55°C; Max Operating Temperature: 125°C; Packaging: Rail/Tube; Number of Rows: 1; Termination: Solder; Gender: Receptacle; Orientation: Horizontal; Connector Type: Receptacle; Fastening Type: Pull; Series: SMH; Contact Type: Forked; Number of Positions: 5; Radiation Hardening: No; RoHS Compliant: Yes; Reach SVHC Compliant: No; Flammability Rating: UL94 V-0; ComponentLink1URL: http://www.farnell.com/datasheets/1927708.pdf?_ga=2.237598468.569325269.1503285096-1413671594.1503025027&src-supplier=Farnell; ComponentLink1Description: http://www.farnell.com/datasheets/1927708.pdf?_ga=2.237598468.569325269.1503285096-1413671594.1503025027&src-supplier=Farnell; ComponentLink2URL: http://www.samtec.com/documents/webfiles/pdf/SMH.PDF?src-supplier=Newark; ComponentLink2Description: http://www.samtec.com/documents/webfiles/pdf/SMH.PDF?src-supplier=Newark; ComponentLink3URL: http://www.samtec.com/documents/webfiles/pdf/SMH.PDF?src-supplier=Avnet; ComponentLink3Description: http://www.samtec.com/documents/webfiles/pdf/SMH.PDF?src-supplier=Avnet; ComponentLink4URL: http://suddendocs.samtec.com/catalog_english/smh.pdf?src-supplier=Digikey; ComponentLink4Description: http://suddendocs.samtec.com/catalog_english/smh.pdf?src-supplier=Digikey
J7 = TUNIK 6P 2.5mm: Header B6B-ZR, 1.50mm, 6-contacts, top entry, THT, /2000/box; Manufacturer: JST; Gender: 29Gender; Number of Contacts: 6NUMBER; Designed By: SEFA; Supplier: Digikey; Supplier Part Number: 455-B6B-ZR-ND; Manufacturer Part Number: B6B-ZR; RoHS: Yes; Category: Board to Board Connectors; Stock: 104604; Pricing: 1=0,3, 10=0,256, 100=0,1994, 2000=0,13512, 6000=0,1221, 10000=0,11396 (USD); Housing Color: 50Colour; Orientation: 5495OrientationType; Lead Free: 5698LeadFree; ComponentLink1URL: https://datasheet.ciiva.com/6905/zhconnector-6905949.pdf?src-supplier=Digikey; ComponentLink1Description: https://datasheet.ciiva.com/6905/zhconnector-6905949.pdf?src-supplier=Digikey
J8 = MICRO B USB CONN: CONN USB MICRO B RECPT SMT R/A; Manufacturer: Amphenol ICC / FCI; Manufacturer Part Number: 10118192-0001LF; Gender: Receptacle; Connector Type: USB,Receptacle; Number of Contacts: 5; Current Rating: 1.8A; Insulation Resistance: 1GR; Number of Ports: 1; Max Voltage Rating (AC): 100V; Pitch: 0.65mm; Designed By: SEFA; Supplier: Digikey; Supplier Part Number: 609-4613-1-ND; RoHS: No; Category: Uncategorized; Stock: 54967; Pricing: 1=0,57, 10=0,43, 25=0,3864, 50=0,3566, 100=0,3293, 250=0,29696, 500=0,27504, 1400=0,24362, 2800=0,22849, 4200=0,2196, 7000=0,2086, 9800=0,20179, 14000=0,19492, 35000=0,17937 (USD); Mounting Technology: Surface Mount,Horizontal; Pins: 5; Color: Black; Contact Material: Copper Alloy; Contact Plating: Gold; Housing Material: Polymer; Min Operating Temperature: -55°C; Max Operating Temperature: 85°C; Orientation: Right Angle; Features: Shielded; USB Standard: USB 2.0; Termination: Solder; Voltage Rating: 100V; Series: -; Packaging: Tape and Reel; Package Quantity: 1400; Length: 7.86mm; Depth: 5.57mm; Radiation Hardening: No; Flammability Rating: UL94 V-0; Reach SVHC Compliant: No
L1 = IND 47uH: Power Inductor, Aec-Q200, 47Uh, 0.39A Rohs Compliant: Yes |Wurth Elektronik 78438335470; Manufacturer: Wurth Electronics; Core Material: Ferrite; Saturation Current: 1.18A; Shielding: Shielded; DC Resistance (DCR): 2.3R; Self Resonant Frequency: 8MHz; Test Frequency: 100kHz; Tolerance: 30%; Designed By: SEFA; Supplier: Digikey; Supplier Part Number: 732-6947-1-ND; Manufacturer Part Number: 78438335470; RoHS: Yes; Category: Fixed Inductors; Stock: 680; Pricing: 1=2,11, 50=1,97, 250=1,803, 500=1,672 (USD); Mounting Technology: Surface Mount; Case/Package: 1212; Case Code (Metric): 3030; Case Code (Imperial): 1212; Min Operating Temperature: -40°C; Max Operating Temperature: 125°C; Packaging: Cut Tape; Current Rating: 390mA; Series: WE-MAIA; Length: 0.118inch; Width: 0.118inch; Height - Seated (Max): 0.059inch; Ratings: AEC-Q200; RoHS Compliant: Yes; ComponentLink1URL: https://media.digikey.com/pdf/Data%20Sheets/Wurth%20Electronics%20PDFs/Q+_Products_Flyer.pdf?src-supplier=Digikey; ComponentLink1Description: https://media.digikey.com/pdf/Data%20Sheets/Wurth%20Electronics%20PDFs/Q+_Products_Flyer.pdf?src-supplier=Digikey
Q1 Q2 = MMBT3904 NPN TR: Transistor: NPN; bipolar; 40V; 0.2A; 350mW; -55+150 deg.C; SMD; SOT23; Manufacturer: Diotec; Designed By: SEFA; Supplier: Mouser; Supplier Part Number: 637-MMBT3904; Manufacturer Part Number: MMBT3904; RoHS: Yes; Category: BJTs; Stock: 65126; Pricing: 1=0,1, 10=0,057, 50=0,057, 100=0,047, 1000=0,033, 10000=0,016 (USD); ComponentLink1URL: http://datasheet.octopart.com/MMBT3904-Diotec-datasheet-20771870.pdf?src-supplier=Verical; ComponentLink1Description: http://datasheet.octopart.com/MMBT3904-Diotec-datasheet-20771870.pdf?src-supplier=Verical; ComponentLink2URL: http://datasheet.octopart.com/MMBT3904-Diotec-datasheet-20771870.pdf?src-supplier=Mouser; ComponentLink2Description: http://datasheet.octopart.com/MMBT3904-Diotec-datasheet-20771870.pdf?src-supplier=Mouser; ComponentLink3URL: http://datasheet.octopart.com/MMBT3904-Diotec-datasheet-20771870.pdf?src-supplier=Onlinecomponents.com; ComponentLink3Description: http://datasheet.octopart.com/MMBT3904-Diotec-datasheet-20771870.pdf?src-supplier=Onlinecomponents.com; ComponentLink4URL: http://datasheet.octopart.com/MMBT3904-Diotec-datasheet-20771870.pdf?src-supplier=Distrelec; ComponentLink4Description: http://datasheet.octopart.com/MMBT3904-Diotec-datasheet-20771870.pdf?src-supplier=Distrelec; ComponentLink5URL: http://datasheet.octopart.com/MMBT3904-Diotec-datasheet-20771870.pdf?src-supplier=DComponents; ComponentLink5Description: http://datasheet.octopart.com/MMBT3904-Diotec-datasheet-20771870.pdf?src-supplier=DComponents; ComponentLink6URL: https://datasheet.octopart.com/MMBT3904-Diotec-datasheet-137255044.pdf?src-supplier=TME; ComponentLink6Description: https://datasheet.octopart.com/MMBT3904-Diotec-datasheet-137255044.pdf?src-supplier=TME; ComponentLink7URL: http://datasheet.octopart.com/MMBT3904-Diotec-datasheet-20771870.pdf?src-supplier=Rutronik; ComponentLink7Description: http://datasheet.octopart.com/MMBT3904-Diotec-datasheet-20771870.pdf?src-supplier=Rutronik; ComponentLink8URL: http://datasheet.octopart.com/MMBT3904-Diotec-datasheet-20771870.pdf?src-supplier=Electro+Sonic; ComponentLink8Description: http://datasheet.octopart.com/MMBT3904-Diotec-datasheet-20771870.pdf?src-supplier=Electro+Sonic; ComponentLink9URL: https://datasheet.octopart.com/MMBT3904-Diotec-datasheet-168810005.pdf?src-supplier=SOS+electronic; ComponentLink9Description: https://datasheet.octopart.com/MMBT3904-Diotec-datasheet-168810005.pdf?src-supplier=SOS+electronic
R1 = RES 270mR 5WD27: 270 mOhms ±5% 5W Through Hole Resistor Axial Wirewound
R2-R5 = RES 10K OHM 0603: Res Thick Film 0603 10K Ohm 5% 1/10W ±100ppm/°C Molded SMD SMD Paper T/R; Manufacturer: Stackpole Electronics; Manufacturer Part Number: RMCF0603JT10K0; Designed By: SEFA; Supplier: Digikey; Supplier Part Number: RMCF0603JT10K0CT-ND; RoHS: Yes; Category: Chip SMD Resistors; Stock: 14247729; Pricing: 1=0,1, 10=0,021, 50=0,0116, 100=0,0093, 500=0,00594, 1000=0,005 (USD); ComponentLink1URL: https://datasheet.ciiva.com/15193/getdatasheetpartid-364254-15193501.pdf?src-supplier=Verical; ComponentLink1Description: https://datasheet.ciiva.com/15193/getdatasheetpartid-364254-15193501.pdf?src-supplier=Verical
T1 = BV302S12010-ZU: Sealed Transformer EI30/10.5; Manufacturer: Zettler Magnetics; Desined By: SEFA; Supplier: Digikey; Supplier Part Number: 3388-BV302S12010-ND; Manufacturer Part Number: BV302S12010; RoHS: No; Category: Uncategorized; Stock: 935; Pricing: 1=3,47, 10=2,553, 25=2,3068, 50=2,1534, 100=2,0233, 250=1,8816, 500=1,79342, 1000=1,71882, 5000=1,58704 (USD); RoHS Compliant: No
U1 = LM2675: SIMPLE SWITCHER® 6.5V to 40V, 1A Low Component Count Step-Down Regulator 8-SOIC -40 to 125; Manufacturer: TI National Semiconductor; Manufacturer Part Number: LM2675M-5.0; Output Voltage: 5V; Number of Outputs: 1; Switching Frequency: 260kHz; Quiescent Current: 2.5mA; Output Type: Fixed; Synchronous Rectifier: No; Output Configuration: Positive; Efficiency: 90%; Designed By: SEFA; Supplier: Mouser; Supplier Part Number: 926-LM2675M-50; RoHS: No; Category: Voltage Regulators - Switching; Stock: 7217; Pricing: 1=6,97, 10=6,3, 50=6,01, 100=5,33, 1000=5,33, 10000=5,33 (USD); Mounting Technology: Surface Mount; Case/Package: SOIC; Pins: 8; Min Operating Temperature: -40°C; Max Operating Temperature: 125°C; Max Supply Voltage: 40V; Output Current: 1A; Min Input Voltage: 6.5V; Packaging: Rail/Tube; Series: SIMPLE SWITCHER®; Max Output current: 1A; Min Output Voltage: 5V; Max Output Voltage: 5V; Min Supply Voltage: 6.5V; Nominal Output Voltage: 5V; Frequency: 260kHz; Current Rating: 1A; Lead Free: Contains Lead; RoHS Compliant: No; Reach SVHC Compliant: No; ComponentLink1URL: https://datasheet.ciiva.com/23730/1767222-23730836.pdf?src-supplier=Newark; ComponentLink1Description: https://datasheet.ciiva.com/23730/1767222-23730836.pdf?src-supplier=Newark; ComponentLink2URL: https://datasheet.ciiva.com/7994/1896108-7994300.pdf?src-supplier=Element14; ComponentLink2Description: https://datasheet.ciiva.com/7994/1896108-7994300.pdf?src-supplier=Element14
U2 = AP7361-33E-13: AP7361 Series 3.3 V 1 A Low SMT Dropout Fixed-Mode Regulator - SOT-223; Manufacturer: Diodes; Number of Outputs: 1; Min Input Voltage: 2.2V; Max Supply Voltage: 6V; Max Output current: 1A; Output Voltage: 3.3V; Max Power Dissipation: 1.1W; Dropout Voltage: 500mV; Min Current Limit: 1.1A; Polarity: Positive; Quiescent Current: 70uA; Power Dissipation: 1.1kW; Accuracy: 1%; Power Supply Rejection Ratio (PSRR): 65dB; Reference Voltage: 800mV; Output Type: Fixed; Designed By: SEFA; Supplier: Digikey; Supplier Part Number: AP7361-33E-13DICT-ND; Manufacturer Part Number: AP7361-33E-13; RoHS: Yes; Category: Voltage Regulators - Linear; Stock: 111462; Pricing: 1=0,51, 10=0,414, 25=0,3788, 100=0,2818, 250=0,2554, 500=0,21138, 1000=0,15853 (USD); Mounting Technology: Surface Mount; Case/Package: SOT-223; Pins: 4; Weight: 0.000282oz; Contact Plating: Tin,Matte; Min Operating Temperature: -40°C; Max Operating Temperature: 85°C; Package Quantity: 1; Packaging: Tape and Reel; Output Current: 1A; Number of Regulators: 1; Series: -; Radiation Hardening: No; Reach SVHC Compliant: Yes; Lead Free: Lead Free; RoHS Compliant: Yes; ComponentLink1URL: https://datasheet.ciiva.com/26926/getdatasheetpartid-670786-26926141.pdf?src-supplier=Verical; ComponentLink1Description: https://datasheet.ciiva.com/26926/getdatasheetpartid-670786-26926141.pdf?src-supplier=Verical; ComponentLink2URL: https://datasheet.ciiva.com/29568/ap7361-29568378.pdf?src-supplier=Digikey; ComponentLink2Description: https://datasheet.ciiva.com/29568/ap7361-29568378.pdf?src-supplier=Digikey
U3 U4 = ALQ112: Electromechanical Relay 12VDC 360Ohm 10(NO)/3(NC)A SPDT (( 20mm 10mm 16mm)) THT Power Relay; Manufacturer: Panasonic; Designed By: SEFA; Supplier: Mouser; Supplier Part Number: 769-ALQ112; Manufacturer Part Number: ALQ112; RoHS: Yes; Category: Power Relays; Stock: 2177; Pricing: 1=1,28, 10=1,28, 50=1,28, 100=1,26, 1000=1,26, 10000=1,26 (USD); ComponentLink1URL: https://datasheet.ciiva.com/24388/307ds-61b20-en-lq-24388909.pdf?src-supplier=Onlinecomponents.com; ComponentLink1Description: https://datasheet.ciiva.com/24388/307ds-61b20-en-lq-24388909.pdf?src-supplier=Onlinecomponents.com